# EAGLE design DummyLoad_(ResistorArray) (EAGLE 7.1.0)
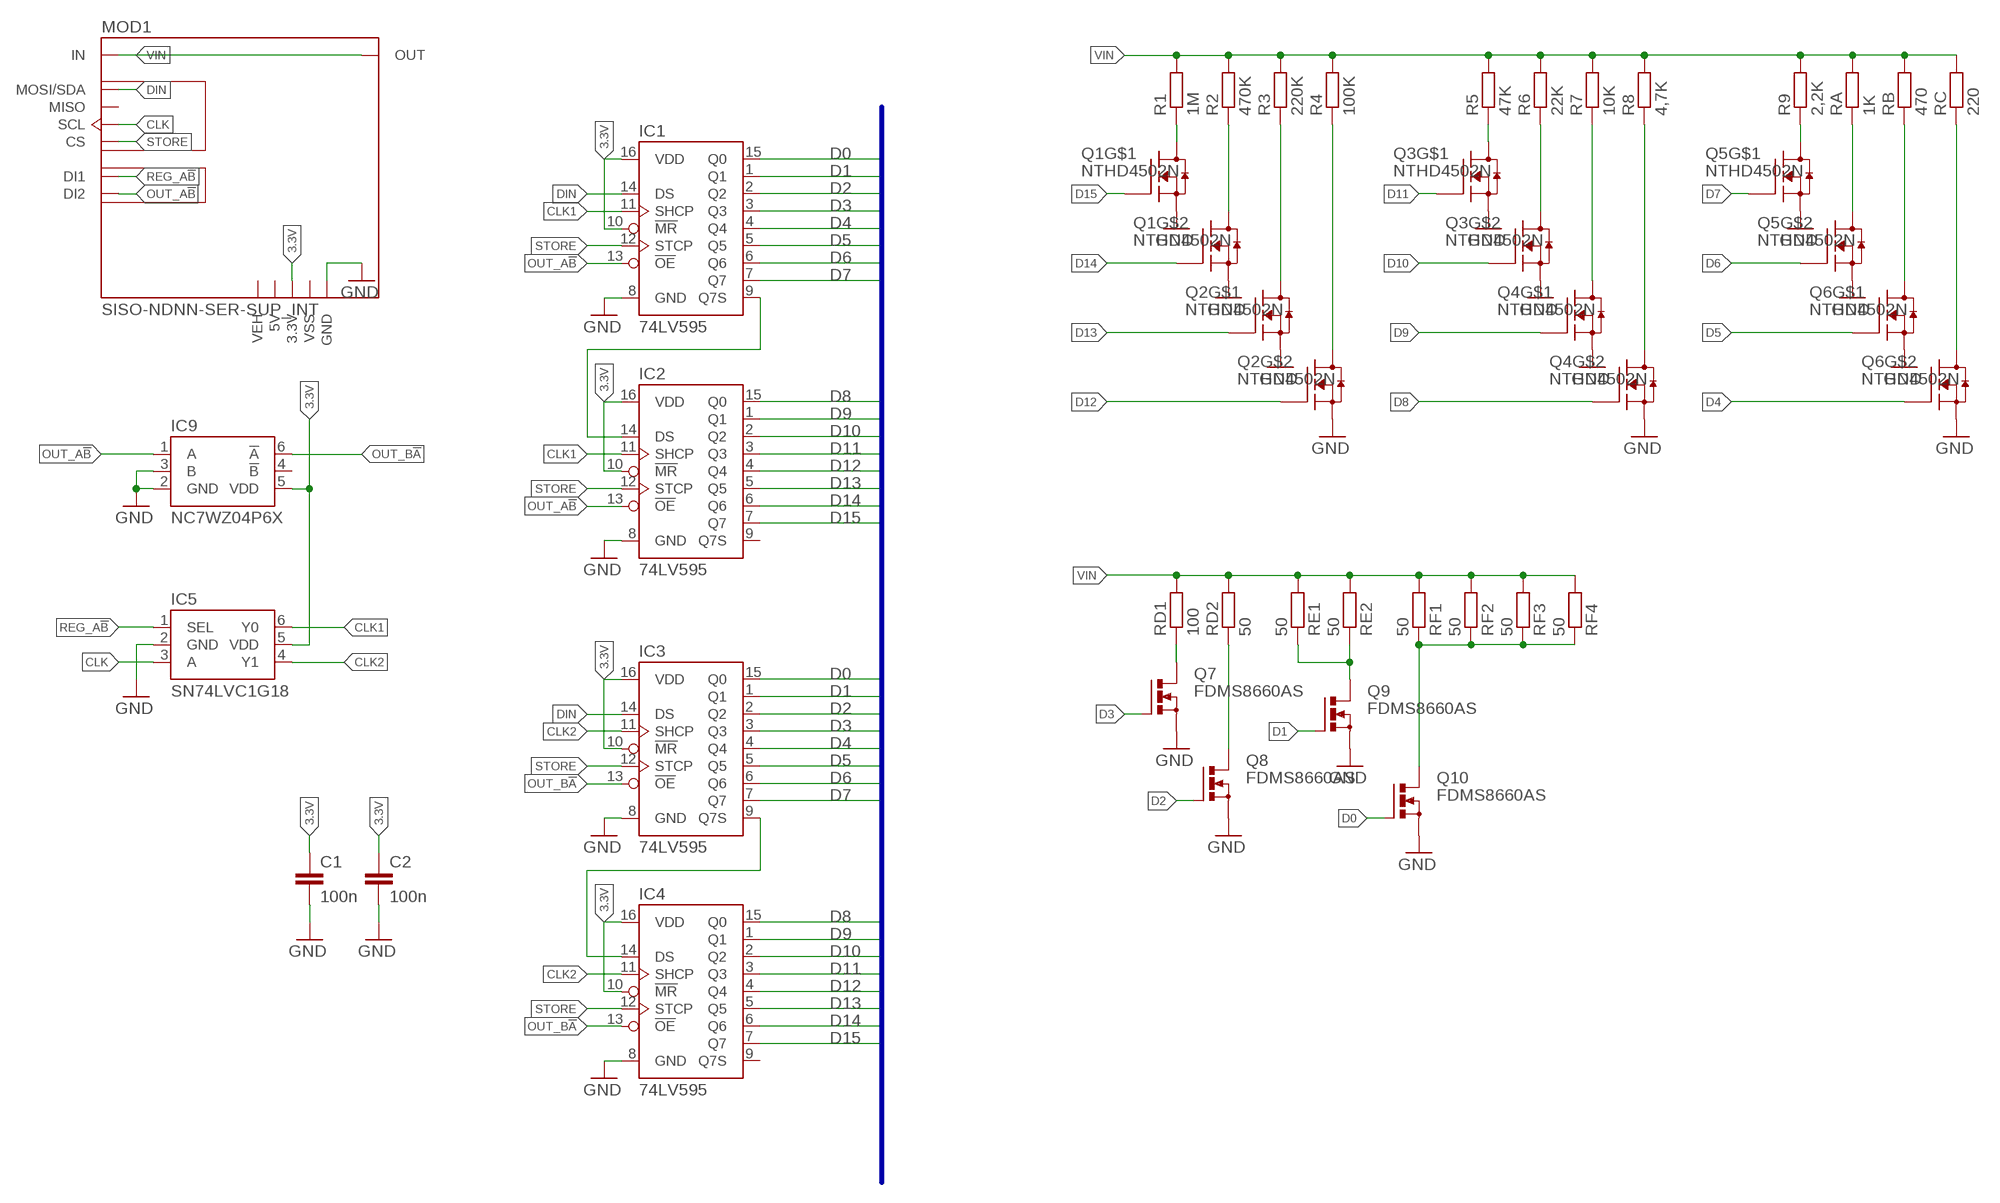
[diagram p0: schematic, sheet 1]

## Parts
C1  100n  C-EUC0805K  [C0805K]
C2  100n  C-EUC0805K  [C0805K]
IC1  74LV595  [TSSOP16]
IC2  74LV595  [TSSOP16]
IC3  74LV595  [TSSOP16]
IC4  74LV595  [TSSOP16]
IC5  SN74LVC1G18  [SOT65]
IC9  NC7WZ04P6X  [SOT65P210X110-6N]
MOD1  SISO-NDNN-SER-SUP_INT  [SISO-NDNN-SER-SUP]
Q1  NTHD4502N  [1206A_CHIPFET]
Q2  NTHD4502N  [1206A_CHIPFET]
Q3  NTHD4502N  [1206A_CHIPFET]
Q4  NTHD4502N  [1206A_CHIPFET]
Q5  NTHD4502N  [1206A_CHIPFET]
Q6  NTHD4502N  [1206A_CHIPFET]
Q7  FDMS8660AS  BSZ105N04NS  [PG-TDSON-8]
Q8  FDMS8660AS  BSZ105N04NS  [PG-TDSON-8]
Q9  FDMS8660AS  BSZ105N04NS  [PG-TDSON-8]
Q10  FDMS8660AS  BSZ105N04NS  [PG-TDSON-8]
R1  1M  R-EU_R0805  [R0805]
R2  470K  R-EU_R0805  [R0805]
R3  220K  R-EU_R0805  [R0805]
R4  100K  R-EU_R0805  [R0805]
R5  47K  R-EU_R0805  [R0805]
R6  22K  R-EU_R0805  [R0805]
R7  10K  R-EU_R0805  [R0805]
R8  4,7K  R-EU_R0805  [R0805]
R9  2,2K  R-EU_R0805  [R0805]
RA  1K  R-EU_R0805  [R0805]
RB  470  R-EU_R0805  [R0805]
RC  220  R-EU_R0805  [R0805]
RD1  100  R-EU_R1206  [R1206]
RD2  50  R-EU_R1206  [R1206]
RE1  50  R-EU_R1206  [R1206]
RE2  50  R-EU_R1206  [R1206]
RF1  50  R-EU_R1206  [R1206]
RF2  50  R-EU_R1206  [R1206]
RF3  50  R-EU_R1206  [R1206]
RF4  50  R-EU_R1206  [R1206]

## Nets
3.3V: C1.1 C2.1 IC1.10(!MR) IC1.16(VDD) IC2.10(!MR) IC2.16(VDD) IC3.10(!MR) IC3.16(VDD) IC4.10(!MR) IC4.16(VDD) IC5.5(VDD) IC9.5(VDD) MOD1.3.3V
CLK: IC5.3(A) MOD1.SCL
CLK1: IC1.11(SHCP) IC2.11(SHCP) IC5.6(Y0)
CLK2: IC3.11(SHCP) IC4.11(SHCP) IC5.4(Y1)
D0: IC1.15(Q0) IC3.15(Q0) Q10.4(G)
D1: IC1.1(Q1) IC3.1(Q1) Q9.4(G)
D2: IC1.2(Q2) IC3.2(Q2) Q8.4(G)
D3: IC1.3(Q3) IC3.3(Q3) Q7.4(G)
D4: IC1.4(Q4) IC3.4(Q4) Q6.4(G)
D5: IC1.5(Q5) IC3.5(Q5) Q6.2(G)
D6: IC1.6(Q6) IC3.6(Q6) Q5.4(G)
D7: IC1.7(Q7) IC3.7(Q7) Q5.2(G)
D8: IC2.15(Q0) IC4.15(Q0) Q4.4(G)
D9: IC2.1(Q1) IC4.1(Q1) Q4.2(G)
D10: IC2.2(Q2) IC4.2(Q2) Q3.4(G)
D11: IC2.3(Q3) IC4.3(Q3) Q3.2(G)
D12: IC2.4(Q4) IC4.4(Q4) Q2.4(G)
D13: IC2.5(Q5) IC4.5(Q5) Q2.2(G)
D14: IC2.6(Q6) IC4.6(Q6) Q1.4(G)
D15: IC2.7(Q7) IC4.7(Q7) Q1.2(G)
DIN: IC1.14(DS) IC3.14(DS) MOD1.MOSI/SDA
GND: C1.2 C2.2 IC1.8(GND) IC2.8(GND) IC3.8(GND) IC4.8(GND) IC5.2(GND) IC9.2(GND) IC9.3(B) MOD1.GND1(GND) MOD1.GND2(GND) MOD1.GND3(GND) MOD1.GND4(GND) Q1.1(S) Q1.3(S) Q2.1(S) Q2.3(S) Q3.1(S) Q3.3(S) Q4.1(S) Q4.3(S) Q5.1(S) Q5.3(S) Q6.1(S) Q6.3(S) Q7.1(S) Q7.2(S) Q7.3(S) Q8.1(S) Q8.2(S) Q8.3(S) Q9.1(S) Q9.2(S) Q9.3(S) Q10.1(S) Q10.2(S) Q10.3(S)
N$1: Q7.5(D) Q7.6(D) Q7.7(D) Q7.8(D) Q7.TH(D) RD1.1
N$2: Q1.7(D) Q1.8(D) R1.1
N$3: IC1.9(Q7S) IC2.14(DS)
N$4: IC3.9(Q7S) IC4.14(DS)
N$5: Q5.7(D) Q5.8(D) R9.1
N$6: Q5.5(D) Q5.6(D) RA.1
N$7: Q6.7(D) Q6.8(D) RB.1
N$8: Q6.5(D) Q6.6(D) RC.1
N$9: Q1.5(D) Q1.6(D) R2.1
N$10: Q2.7(D) Q2.8(D) R3.1
N$11: Q8.5(D) Q8.6(D) Q8.7(D) Q8.8(D) Q8.TH(D) RD2.1
N$12: Q2.5(D) Q2.6(D) R4.1
N$13: Q3.7(D) Q3.8(D) R5.1
N$14: Q9.5(D) Q9.6(D) Q9.7(D) Q9.8(D) Q9.TH(D) RE1.1 RE2.1
N$15: Q3.5(D) Q3.6(D) R6.1
N$16: Q4.7(D) Q4.8(D) R7.1
N$17: Q4.5(D) Q4.6(D) R8.1
N$22: Q10.5(D) Q10.6(D) Q10.7(D) Q10.8(D) Q10.TH(D) RF1.1 RF2.1 RF3.1 RF4.1
OUT_A!B: IC1.13(!OE) IC2.13(!OE) IC9.1(A) MOD1.DI2
OUT_B!A: IC3.13(!OE) IC4.13(!OE) IC9.6(!A)
REG_A!B: IC5.1(SEL) MOD1.DI1
STORE: IC1.12(STCP) IC2.12(STCP) IC3.12(STCP) IC4.12(STCP) MOD1.CS
VIN: MOD1.IN1(IN) MOD1.IN2(IN) MOD1.IN3(IN) MOD1.IN4(IN) MOD1.OUT1(OUT) MOD1.OUT2(OUT) MOD1.OUT3(OUT) MOD1.OUT4(OUT) R1.2 R2.2 R3.2 R4.2 R5.2 R6.2 R7.2 R8.2 R9.2 RA.2 RB.2 RC.2 RD1.2 RD2.2 RE1.2 RE2.2 RF1.2 RF2.2 RF3.2 RF4.2
Unconnected: IC2.9(Q7S) IC4.9(Q7S) IC9.4(!B) MOD1.MISO

## Buses
D[0..15]

## Power pins joined to a net without a drawn wire
5V: MOD1.5V
VEH: MOD1.VEH
VSS: MOD1.VSS

## Library data of the parts
C1 C2 = rcl:C-EU: CAPACITOR, European symbol
IC1-IC4 = 74LV595:74LV595
IC5 = SN74LVC1G18:SN74LVC1G18
IC9 = NC7WZ04-P6:NC7WZ04P6X: UHS Dual Inverter; MPN: NC7WZ04P6X; OC_FARNELL: 1417665; OC_NEWARK: 58K1999; PACKAGE: SC-70-6; SUPPLIER: FAIRCHILD SEMICONDUCTOR
MOD1 = AllModules:SISO-NDNN-SER-SUP_INT
Q1-Q6 = Dual-MOSFETs:NTHD4502N
Q7-Q10 = transistor-power:BSZ105N04NS: OptiMOS (TM)3 Power-Transistor N-Channel, Normal level Source : Data sheet <http://www.infineon.com/dgdl/BSZ105N04NSG_rev1.1.pdf?folderId=db3a3043156fd5730115c7d50620107c&fileId=db3a30431689f4420116c485c67f084e>
R1-R9 RA RB RC RD1 RD2 RE1 RE2 RF1-RF4 = rcl:R-EU_: RESISTOR, European symbol

## Board
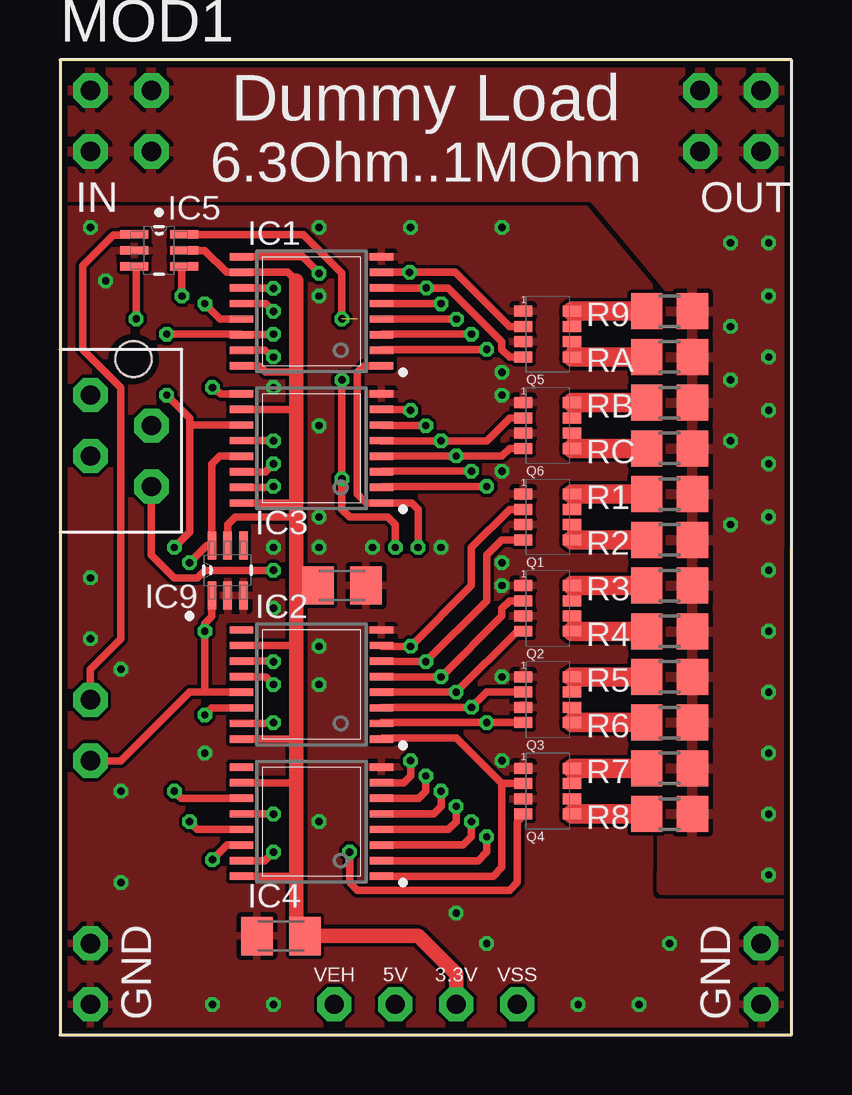
[diagram p1: board, top side]
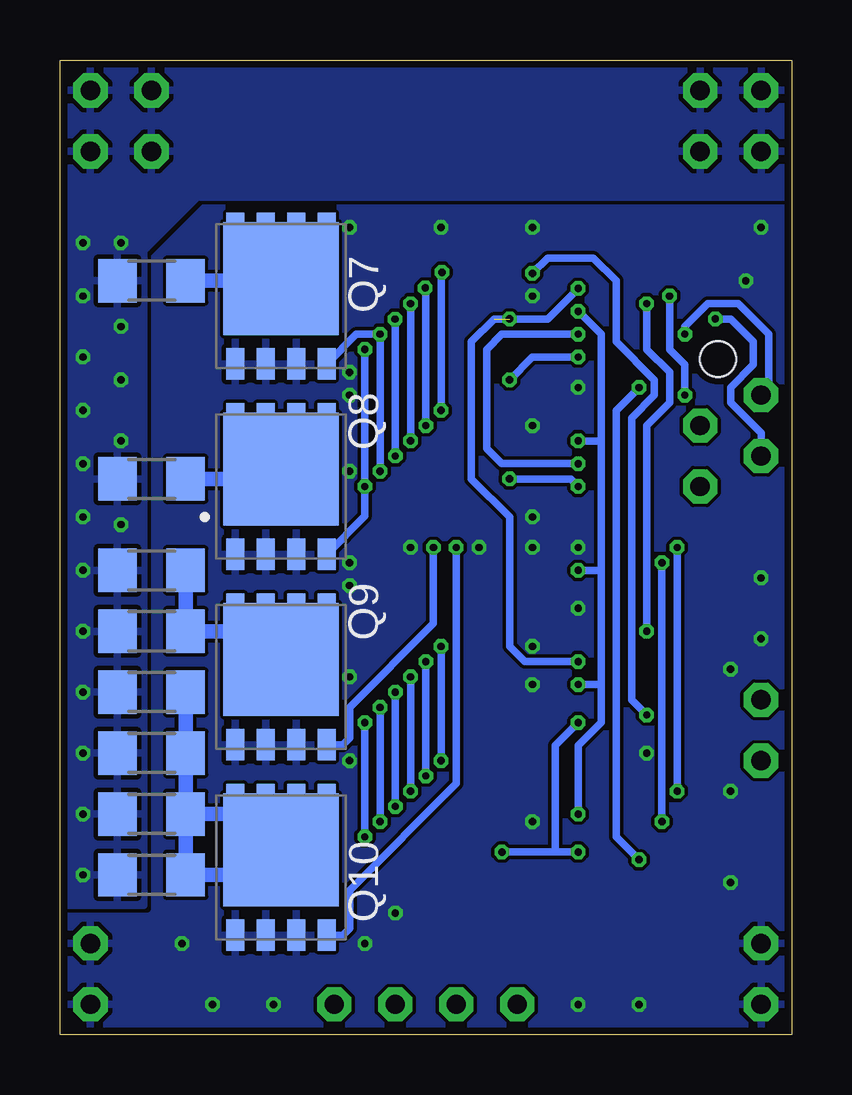
[diagram p2: board, bottom side, seen from below]

Size 30.48 x 40.64 mm. Coordinates in mm from the lower left corner, seen from the top.
Outline: 0,0 30.46,0 30.48,40.64 0,40.64 0,0
Copper layers (1*16): Top 0.035mm / dielectric 1.5mm / Bottom 0.035mm
Design rules "PCB-POOL Standard": minimum track width 0.15mm, minimum drill 0.3mm, track to track 0.15mm, track to pad 0.15mm, pad to pad 0.15mm, via to via 0.15mm, smd to smd 0.15mm, copper to edge 0.3mm, drill to drill 0.2mm, minimum pad ring 0.2mm, minimum via ring 0.15mm, stop-mask expansion 0.075mm, vias tented up to drill 0mil, thermal gap 0.2mm

### Footprints (pad centres in the part's own frame; a part is rotated, then mirrored left to right if it is on the bottom)
C0805K = smd 1.3 x 1.6: 1 -1,0; 2 1,0
TSSOP16 = smd 0.991 x 0.305: 1 -2.918,2.275; 2 -2.918,1.625; 3 -2.918,0.975; 4 -2.918,0.325; 5 -2.918,-0.325; 6 -2.918,-0.975; 7 -2.918,-1.625; 8 -2.918,-2.275; 9 2.918,-2.275; 10 2.918,-1.625; 11 2.918,-0.975; 12 2.918,-0.325; 13 2.918,0.325; 14 2.918,0.975; 15 2.918,1.625; 16 2.918,2.275
SOT65 = smd 1.168 x 0.356: 1 -1.041,0.66; 2 -1.041,0; 3 -1.041,-0.66; 4 1.041,-0.66; 5 1.041,0; 6 1.041,0.66
SOT65P210X110-6N = smd 1.168 x 0.356: 1 -1.041,0.66; 2 -1.041,0; 3 -1.041,-0.66; 4 1.041,-0.66; 5 1.041,0; 6 1.041,0.66
SISO-NDNN-SER-SUP = drill 0.8 pad 1.422 octagon: 3.3V 15.24,-38.1; 5V 12.7,-38.1; CS 2.54,-16.51; DI1 0,-25.4; DI2 0,-27.94; GND1 0,-38.1; GND2 0,-35.56; GND3 27.94,-35.56; GND4 27.94,-38.1; IN1 0,0; IN2 0,-2.54; IN3 2.54,0; IN4 2.54,-2.54; MISO 2.54,-13.97; MOSI/SDA 0,-12.7; OUT1 25.4,0; OUT2 25.4,-2.54; OUT3 27.94,0; OUT4 27.94,-2.54; SCL 0,-15.24; VEH 10.16,-38.1; VSS 17.78,-38.1 | hole 1.5: 1.8,-11.2
1206A_CHIPFET = smd 0.762 x 0.457: 1 -1.016,0.635; 2 -1.016,0; 3 -1.016,-0.635; 4 -1.016,-1.27; 5 1.016,-1.27; 6 1.016,-0.635; 7 1.016,0; 8 1.016,0.635
PG-TDSON-8 = smd 1.3 x 0.75: 1 -2.825,1.905; 2 -2.825,0.635; 3 -2.825,-0.635; 4 -2.825,-1.905; 5 2.825,-1.905; 6 2.825,-0.635; 7 2.825,0.635; 8 2.825,1.905 | smd 4.7 x 4.8: TH 0.725,0
R0805 = smd 1.3 x 1.5: 1 -0.95,0; 2 0.95,0
R1206 = smd 1.6 x 1.803: 1 -1.422,0; 2 1.422,0

### Placement (x,y rotation side)
C1  9.21,4.13 180 top
C2  11.75,18.73 0 top
IC1  10.48,30.16 180 top
IC2  10.48,14.61 180 top
IC3  10.48,24.45 180 top
IC4  10.48,8.89 180 top
IC5  4.13,32.7 0 top
IC9  6.99,19.37 90 top
MOD1  1.27,39.37 0 top
Q1  20.32,21.91 0 top
Q2  20.32,18.1 0 top
Q3  20.32,14.29 0 top
Q4  20.32,10.48 0 top
Q5  20.32,29.53 0 top
Q6  20.32,25.72 0 top
Q7  21.27,30.8 90 bottom
Q8  21.27,22.86 90 bottom
Q9  21.27,14.92 90 bottom
Q10  21.27,6.98 90 bottom
R1  25.4,22.54 0 top
R2  25.4,20.64 0 top
R3  25.4,18.73 0 top
R4  25.4,16.83 0 top
R5  25.4,14.92 0 top
R6  25.4,13.02 0 top
R7  25.4,11.11 0 top
R8  25.4,9.21 0 top
R9  25.4,30.16 0 top
RA  25.4,28.26 0 top
RB  25.4,26.35 0 top
RC  25.4,24.45 0 top
RD1  26.67,31.43 180 bottom
RD2  26.67,23.18 180 bottom
RE1  26.67,19.37 180 bottom
RE2  26.67,16.83 180 bottom
RF1  26.67,14.29 180 bottom
RF2  26.67,11.75 180 bottom
RF3  26.67,9.21 180 bottom
RF4  26.67,6.67 180 bottom

### Tracks (layer width: path | path; a pad name or v marks a point on that pad's centre or on a via)
3.3V
  Top 0.305: 9.84,31.43 9.49,31.79 IC1.10 6.95,31.79 6.03,32.7 IC5.5 | IC1.16 8.31,27.89 8.57,27.62 9.84,27.62 | IC3.10 9.8,26.07 9.84,26.04 | IC3.16 9.79,22.17 9.84,22.22 | IC2.10 9.8,16.23 9.84,16.19 | IC2.16 9.58,12.33 9.84,12.07 | IC4.10 9.8,10.52 9.84,10.48 | IC4.16 9.79,6.62 9.84,6.67 | C2.1 9.84,18.73 | IC9.5 6.99,21.27 7.3,21.59 9.84,21.59
  Top 0.61: 9.84,31.43 9.84,27.62 9.84,26.04 9.84,22.22 9.84,21.59 9.84,18.73 9.84,16.19 9.84,12.07 9.84,10.48 9.84,6.67 9.84,4.81 C1.1 14.92,4.13 16.51,2.54 MOD1.3.3V
CLK  (via drill 0.3)
  Top 0.305: v3.17,29.84 3.17,31.95 IC5.3
  Bottom 0.305: MOD1.SCL 1.27,25.08 2.54,26.35 2.54,26.99 1.59,27.94 1.59,28.89 2.54,29.84 v3.17,29.84
CLK1  (via drill 0.3)  (1 unrouted)
  Top 0.305: IC2.11 8.89,15.58 v8.89,15.56 | IC1.11 8.87,31.14 v8.89,31.11 | IC5.6 10.13,33.36 11.75,31.75 v11.75,29.84
  Bottom 0.305: v8.89,15.56 11.11,15.56 11.75,16.19 11.75,21.59 13.34,23.18 13.34,28.89 12.38,29.84 10.16,29.84 v8.89,31.11
CLK2  (via drill 0.3)
  Top 0.305: IC4.11 5.06,9.87 v4.76,10.16 | v5.08,30.8 5.08,31.95 IC5.4 | v4.45,26.67 5.4,25.72 5.4,25.4 | v4.76,20.32 5.4,20.95 5.4,25.4 | IC3.11 5.42,25.42 5.4,25.4
  Bottom 0.305: v4.76,10.16 v4.76,20.32 | v4.45,26.67 4.45,27.94 5.08,28.57 v5.08,30.8
D0  (via drill 0.3)
  Top 0.305: IC3.15 8.54,22.82 v8.89,22.86 | IC1.15 8.54,28.54 v8.89,28.26 | v11.75,27.3 v11.75,23.18 11.75,21.91 12.07,21.59 13.65,21.59 13.97,21.27 v13.97,20.32
  Bottom 0.305: v11.75,23.18 9.21,23.18 v8.89,22.86 | v13.97,20.32 13.97,10.48 18.41,6.03 18.41,4.45 18.7,4.16 Q10.4 | v8.89,28.26 10.8,28.26 v11.75,27.3
D1  (via drill 0.3)
  Top 0.305: v14.92,20.32 14.92,21.91 14.66,22.17 IC3.1 12.75,22.17 12.38,22.54 12.38,27.62 12.65,27.89 IC1.1
  Bottom 0.305: v14.92,20.32 14.92,17.14 18.41,13.65 18.41,12.38 18.7,12.1 Q9.4
D2  (via drill 0.3)
  Top 0.305: IC1.2 13.43,28.57 v17.78,28.57 | v17.78,22.86 13.43,22.86 IC3.2
  Bottom 0.305: Q8.4 17.78,21.62 v17.78,22.86 v17.78,28.57
D3  (via drill 0.3)
  Top 0.305: IC1.3 13.42,29.21 v17.14,29.21 | v17.14,23.49 13.42,23.49 IC3.3
  Bottom 0.305: v17.14,23.49 v17.14,29.21 18.13,29.21 Q7.4
D4  (via drill 0.3)
  Top 0.305: IC1.4 v16.52,29.84 | IC3.4 v16.5,24.12 v16.51,24.13 18.41,24.13 18.73,24.45 Q6.4
  Bottom 0.305: v16.52,29.84 v16.51,29.83 v16.51,24.13
D5  (via drill 0.3)
  Top 0.305: IC1.5 v15.88,30.48 | IC3.5 v15.88,24.76 17.78,24.76 18.73,25.72 Q6.2
  Bottom 0.305: v15.88,30.48 v15.88,24.76
D6  (via drill 0.3)
  Top 0.305: IC1.6 v15.26,31.14 16.17,31.14 18.41,28.89 18.41,28.57 18.73,28.26 Q5.4 19.05,28.26 | v15.24,25.4 13.42,25.4 IC3.6
  Bottom 0.305: v15.26,31.14 15.24,31.12 v15.24,25.4
D7  (via drill 0.3)
  Top 0.305: IC1.7 v14.57,31.79 16.47,31.79 18.73,29.53 Q5.2 | v14.61,26.04 14.57,26.07 IC3.7
  Bottom 0.305: v14.57,31.79 14.61,31.75 v14.61,26.04
D8  (via drill 0.3)
  Top 0.305: IC4.15 8.54,7.27 v8.89,7.62 | IC2.15 8.54,12.98 v8.89,13.02 | Q4.4 19.37,9.21 19.05,8.89 19.05,6.35 18.73,6.03 12.38,6.03 12.07,6.35 v12.07,7.62
  Bottom 0.305: 9.84,7.62 9.84,12.07 v8.89,13.02 | v12.07,7.62 9.84,7.62 | 9.84,7.62 v8.89,7.62
D9
  Top 0.305: IC2.1 13.45,12.38 16.51,12.38 18.41,10.48 | Q4.2 18.41,10.48 | IC4.1 18.05,6.62 18.41,6.98 18.41,10.48
D10  (via drill 0.3)
  Top 0.305: Q3.4 v17.78,13.02 13.43,13.02 IC2.2 | v17.78,8.26 17.78,7.62 17.43,7.27 IC4.2
  Bottom 0.305: v17.78,13.02 v17.78,8.26
D11  (via drill 0.3)
  Top 0.305: IC2.3 13.42,13.65 v17.14,13.65 17.78,14.29 Q3.2 | v17.14,8.89 17.14,8.26 16.8,7.92 IC4.3
  Bottom 0.305: v17.14,13.65 v17.14,8.89
D12  (via drill 0.3)
  Top 0.305: Q2.4 19.05,16.83 v16.51,14.29 IC2.4 | v16.51,9.53 16.51,8.89 16.18,8.56 IC4.4
  Bottom 0.305: v16.51,14.29 v16.51,9.53
D13  (via drill 0.3)
  Top 0.305: 19.05,18.1 Q2.2 18.73,18.1 18.41,17.78 18.41,17.46 v15.88,14.92 IC2.5 | v15.88,10.16 15.88,9.53 15.57,9.21 IC4.5
  Bottom 0.305: v15.88,14.92 v15.88,10.16
D14  (via drill 0.3)
  Top 0.305: IC2.6 13.42,15.56 v15.24,15.56 17.78,18.1 17.78,20 18.41,20.64 Q1.4 | v15.24,10.79 15.24,10.16 14.95,9.87 IC4.6
  Bottom 0.305: v15.24,15.56 v15.24,10.79
D15  (via drill 0.3)
  Top 0.305: IC2.7 13.43,16.19 v14.61,16.19 17.14,18.73 17.14,20.32 18.73,21.91 Q1.2 | v14.61,11.43 14.61,10.79 14.32,10.52 IC4.7
  Bottom 0.305: v14.61,16.19 v14.61,11.43
DIN  (via drill 0.3)
  Top 0.305: IC3.14 8.55,23.47 v8.89,23.81 | v8.89,29.21 8.87,29.19 IC1.14 7.54,29.21 v4.45,29.21
  Bottom 0.305: v8.89,23.81 12.07,23.81 12.7,24.45 12.7,28.57 12.07,29.21 v8.89,29.21 | MOD1.MOSI/SDA 0.95,26.99 0.95,29.21 2.22,30.48 3.49,30.48 4.45,29.53 v4.45,29.21
GND  (via drill 0.3)
  other vias: 2.54,6.35 8.89,26.99 8.89,17.78 10.8,33.66 10.8,16.19 6.03,11.75 8.89,20.32 2.54,10.16 10.8,25.4 24.13,1.27 18.41,33.66 10.8,8.89 10.8,21.59 10.8,20.32 10.8,30.8 10.8,14.61 2.54,15.24 1.27,19.05 17.78,3.81 25.4,3.81 21.59,1.27 8.89,1.27 6.35,1.27 15.88,20.32 14.61,33.66 18.41,27.62 18.41,26.67 18.41,23.49 18.41,19.68 18.41,18.73 18.41,14.92 18.41,11.43 16.51,5.08 13.02,20.32 1.91,31.43 1.27,33.66 1.27,16.51
  pour Top (rank 3): -0.95,41.59 31.43,41.59 31.43,-0.95 -0.95,-0.95
  pour Bottom (rank 2): -0.32,40.96 30.8,40.96 30.8,-0.32 -0.32,-0.32
N$1
  Bottom 0.305: Q7.8 Q7.7 | Q7.7 Q7.6 Q7.5 | Q7.7 21.27,33.62 Q7.TH
  Bottom 0.61: RD1.1 21.27,31.43 Q7.TH
N$2
  Top 0.406: Q1.7 Q1.8
  Top 0.813: R1.1 Q1.8
N$3  (via drill 0.3)
  Top 0.305: 7.88,32.44 IC1.9 10.11,32.44 v10.8,31.75 | IC2.14 6.33,13.63 v6.03,13.34
  Bottom 0.305: v6.03,13.34 6.67,13.97 6.67,25.72 5.71,26.67 5.71,27.3 7.3,28.89 7.3,31.43 8.25,32.38 10.16,32.38 v10.8,31.75
N$4  (via drill 0.3)
  Top 0.305: IC4.14 6.96,7.92 v6.35,7.3 | IC3.9 6.72,26.72 v6.35,26.99
  Bottom 0.305: v6.35,7.3 7.3,8.26 7.3,26.04 v6.35,26.99
N$5
  Top 0.406: Q5.7 Q5.8
  Top 0.813: R9.1 Q5.8
N$6
  Top 0.406: Q5.5 Q5.6
  Top 0.813: RA.1 Q5.5
N$7
  Top 0.406: Q6.7 Q6.8
  Top 0.813: RB.1 Q6.8
N$8
  Top 0.406: Q6.5 Q6.6
  Top 0.813: RC.1 Q6.5
N$9
  Top 0.406: Q1.5 Q1.6
  Top 0.813: R2.1 Q1.5
N$10
  Top 0.406: Q2.7 Q2.8
  Top 0.813: R3.1 Q2.8
N$11
  Bottom 0.305: Q8.8 Q8.7 | Q8.7 Q8.6 Q8.5 | Q8.7 21.27,25.37 Q8.TH
  Bottom 0.61: RD2.1 21.27,23.18 Q8.TH
N$12
  Top 0.406: Q2.5 Q2.6
  Top 0.813: R4.1 Q2.5
N$13
  Top 0.406: Q3.7 Q3.8
  Top 0.813: R5.1 Q3.8
N$14
  Bottom 0.305: Q9.8 Q9.7 | Q9.7 Q9.6 Q9.5 | Q9.7 21.27,17.43 21.27,16.83
  Bottom 0.61: RE1.1 RE2.1 21.27,16.83 Q9.TH
N$15
  Top 0.406: Q3.5 Q3.6
  Top 0.813: R6.1 Q3.5
N$16
  Top 0.406: Q4.7 Q4.8
  Top 0.813: R7.1 Q4.8
N$17
  Top 0.406: Q4.6 Q4.5
  Top 0.813: R8.1 Q4.5
N$22
  Bottom 0.305: Q10.8 Q10.7 Q10.6 Q10.5
  Bottom 0.61: RF1.1 RF2.1 RF3.1 | RF3.1 RF4.1 21.27,6.67 Q10.TH | RF3.1 23.18,9.21 Q10.8
OUT_A!B  (via drill 0.3)
  Top 0.305: IC1.13 6.67,29.84 v6.03,30.48 | IC9.1 6.33,17.44 6.03,17.14 v6.03,16.83 6.03,14.29 | IC2.13 6.03,14.29 | 6.03,14.29 5.4,14.29 2.54,11.43 MOD1.DI2
  Bottom 0.305: v6.03,16.83 6.03,25.4 5.08,26.35 5.08,27.62 6.03,28.57 v6.03,30.48
OUT_B!A  (via drill 0.3)
  Top 0.305: IC4.13 5.72,8.56 v5.4,8.89 | IC3.13 6.66,24.12 6.33,23.79 IC9.6 6.12,20.41 v5.4,19.68
  Bottom 0.305: v5.4,19.68 v5.4,8.89
REG_A!B
  Top 0.305: MOD1.DI1 1.27,15.24 2.54,16.51 2.54,26.99 0.95,28.57 0.95,32.07 2.22,33.34 3.06,33.34 IC5.1
STORE  (via drill 0.3)
  Top 0.305: IC4.12 8.57,9.21 v8.89,9.21 | IC2.12 8.57,14.93 v8.89,14.61 | 7.61,24.77 IC3.12 8.57,24.77 v8.89,24.76 | v8.89,30.16 8.57,30.49 IC1.12 | v8.89,19.37 6.03,19.37 5.71,19.05 4.76,19.05 3.81,20 MOD1.CS
  Bottom 0.305: 7.94,14.61 7.94,13.02 8.89,12.07 v8.89,9.21 | 7.94,14.61 7.94,19.37 | 7.94,19.37 7.94,24.76 | 7.94,24.76 7.94,29.21 v8.89,30.16 | 7.94,24.76 v8.89,24.76 | v8.89,14.61 7.94,14.61 | v8.89,19.37 7.94,19.37
VIN  (via drill 0.3)
  other vias: 27.94,33.02 27.94,29.53 27.94,24.76 27.94,27.3 27.94,21.27 29.53,19.37 29.53,16.83 29.53,14.29 29.53,11.75 29.53,9.21 29.53,6.67 29.53,21.59 29.53,23.81 29.53,26.04 29.53,28.26 29.53,30.8 29.53,33.02
  pour Top (rank 2): 0,40.64 30.48,40.64 30.16,6.03 25.08,6.03 25.4,31.11 22.22,34.92 0,34.92
  pour Bottom: 0,40.64 30.48,40.64 30.48,5.4 26.99,5.4 26.99,32.7 24.77,34.92 0,34.92

### Text on the board
tNames: Dummy Load | 6.3Ohm..1MOhm
bStop: by Jan Kokert / 18.09.2015